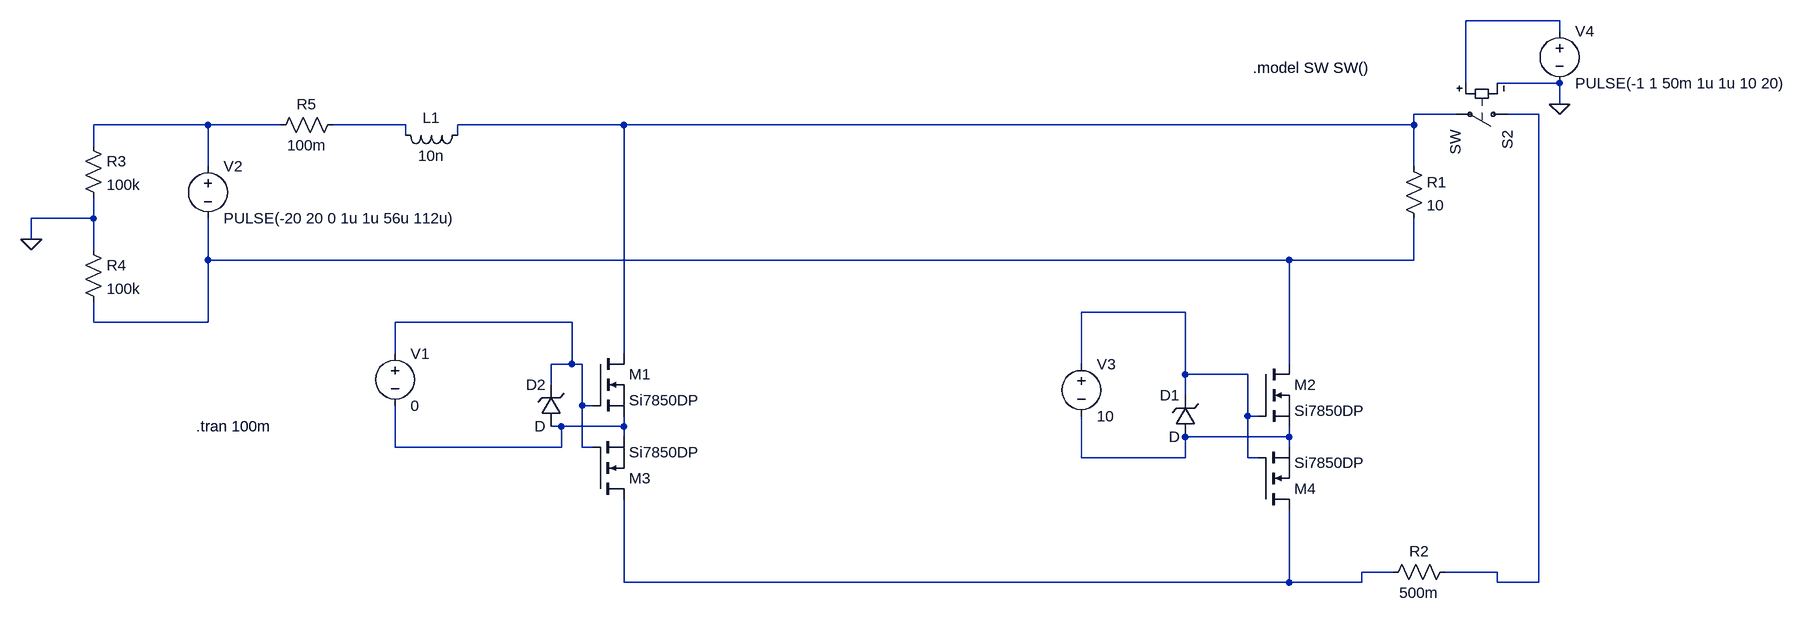
[diagram p0: schematic Tortoise.asc]
Tortoise.asc, the LTspice schematic file:
Version 4
SHEET 1 1300 680
WIRE 896 -448 752 -448
WIRE 896 -432 896 -448
WIRE 752 -352 752 -448
WIRE 896 -352 800 -352
WIRE 896 -320 896 -352
WIRE 736 -304 672 -304
WIRE 864 -304 816 -304
WIRE -1184 -288 -1360 -288
WIRE -1072 -288 -1184 -288
WIRE -880 -288 -992 -288
WIRE -544 -288 -800 -288
WIRE 672 -288 672 -304
WIRE 672 -288 -544 -288
WIRE -880 -272 -880 -288
WIRE -800 -272 -800 -288
WIRE -1360 -256 -1360 -288
WIRE -1184 -224 -1184 -288
WIRE 672 -224 672 -288
WIRE -1360 -144 -1360 -176
WIRE -1360 -144 -1456 -144
WIRE -1456 -112 -1456 -144
WIRE -1360 -96 -1360 -144
WIRE -1184 -80 -1184 -144
WIRE 480 -80 -1184 -80
WIRE 672 -80 672 -144
WIRE 672 -80 480 -80
WIRE 320 0 160 0
WIRE -1360 16 -1360 -16
WIRE -1184 16 -1184 -80
WIRE -1184 16 -1360 16
WIRE -624 16 -896 16
WIRE -896 64 -896 16
WIRE -544 64 -544 -288
WIRE -624 80 -624 16
WIRE -624 80 -656 80
WIRE -608 80 -624 80
WIRE 160 80 160 0
WIRE 480 80 480 -80
WIRE 320 96 320 0
WIRE 416 96 320 96
WIRE -656 112 -656 80
WIRE 320 128 320 96
WIRE -608 144 -608 80
WIRE -592 144 -608 144
WIRE 416 160 416 96
WIRE 432 160 416 160
WIRE -640 176 -656 176
WIRE -544 176 -544 160
WIRE -544 176 -640 176
WIRE -544 192 -544 176
WIRE 480 192 480 176
WIRE 480 192 320 192
WIRE -896 208 -896 144
WIRE -640 208 -640 176
WIRE -640 208 -896 208
WIRE -608 208 -608 144
WIRE -592 208 -608 208
WIRE 480 208 480 192
WIRE 160 224 160 160
WIRE 320 224 320 192
WIRE 320 224 160 224
WIRE 416 224 416 160
WIRE 432 224 416 224
WIRE 640 400 592 400
WIRE 800 400 720 400
WIRE -544 416 -544 288
WIRE 480 416 480 304
WIRE 480 416 -544 416
WIRE 592 416 592 400
WIRE 592 416 480 416
WIRE 800 416 800 400
WIRE 864 416 864 -304
WIRE 864 416 800 416
FLAG -1456 -112 0
FLAG 896 -320 0
SYMBOL nmos -592 64 R0
SYMATTR InstName M1
SYMATTR Value Si7850DP
SYMBOL nmos 432 80 R0
SYMATTR InstName M2
SYMATTR Value Si7850DP
SYMBOL zener 336 192 R180
WINDOW 0 24 64 Left 2
WINDOW 3 24 0 Left 2
SYMATTR InstName D1
SYMBOL zener -640 176 R180
WINDOW 0 24 64 Left 2
WINDOW 3 24 0 Left 2
SYMATTR InstName D2
SYMBOL nmos -592 288 M180
SYMATTR InstName M3
SYMATTR Value Si7850DP
SYMBOL nmos 432 304 M180
SYMATTR InstName M4
SYMATTR Value Si7850DP
SYMBOL voltage -896 48 R0
WINDOW 123 0 0 Left 2
WINDOW 39 0 0 Left 2
SYMATTR InstName V1
SYMATTR Value 0
SYMBOL voltage -1184 -240 R0
WINDOW 123 0 0 Left 2
WINDOW 39 0 0 Left 2
SYMATTR InstName V2
SYMATTR Value PULSE(-20 20 0 1u 1u 56u 112u)
SYMBOL res 656 -240 R0
SYMATTR InstName R1
SYMATTR Value 10
SYMBOL res -1376 -272 R0
SYMATTR InstName R3
SYMATTR Value 100k
SYMBOL res -1376 -112 R0
SYMATTR InstName R4
SYMATTR Value 100k
SYMBOL voltage 160 64 R0
WINDOW 123 0 0 Left 2
WINDOW 39 0 0 Left 2
SYMATTR InstName V3
SYMATTR Value 10
SYMBOL voltage 896 -448 R0
WINDOW 123 0 0 Left 2
WINDOW 39 0 0 Left 2
SYMATTR InstName V4
SYMATTR Value PULSE(-1 1 50m 1u 1u 10 20)
SYMBOL sw 832 -304 R90
SYMATTR InstName S2
SYMBOL ind -784 -288 R90
WINDOW 0 5 56 VBottom 2
WINDOW 3 32 56 VTop 2
SYMATTR InstName L1
SYMATTR Value 10n
SYMBOL res 736 384 R90
WINDOW 0 0 56 VBottom 2
WINDOW 3 32 56 VTop 2
SYMATTR InstName R2
SYMATTR Value 500m
SYMBOL res -976 -304 R90
WINDOW 0 0 56 VBottom 2
WINDOW 3 32 56 VTop 2
SYMATTR InstName R5
SYMATTR Value 100m
TEXT -1202 176 Left 2 !.tran 100m
TEXT 424 -376 Left 2 !.model SW SW()

The netlist it stands for:
* Tortoise.asc
M1 N002 N008 N009 N009 Si7850DP
M2 N006 N007 N010 N010 Si7850DP
D1 N010 N007 D
D2 N009 N008 D
M3 N011 N008 N009 N009 Si7850DP
M4 N011 N007 N010 N010 Si7850DP
V1 N008 N009 0
V2 N004 N006 PULSE(-20 20 0 1u 1u 56u 112u)
R1 N002 N006 10
R3 N004 0 100k
R4 0 N006 100k
V3 N007 N010 10
V4 N001 0 PULSE(-1 1 50m 1u 1u 10 20)
S2 N003 N002 N001 0 SW
L1 N002 N005 10n
R2 N003 N011 500m
R5 N005 N004 100m
.model D D
.lib standard.dio
.model NMOS NMOS
.model PMOS PMOS
.lib standard.mos
.tran 100m
.model SW SW()
.backanno
.end